# EAGLE design skull_white (EAGLE 9.5.2)
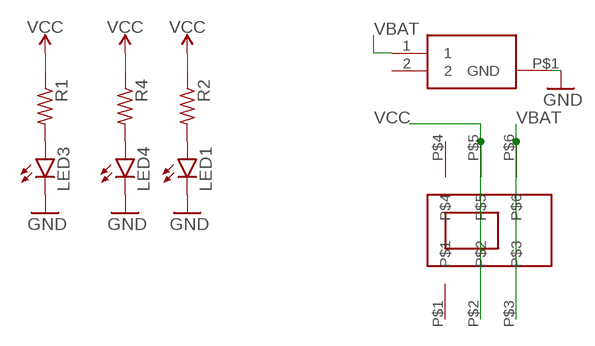
[diagram p0: schematic, sheet 1]

## Parts
LED1  LEDCHIP-LED0805  [CHIP-LED0805]
LED3  LEDCHIP-LED0805  [CHIP-LED0805]
LED4  LEDCHIP-LED0805  [CHIP-LED0805]
R1  R-US_R0603  [R0603]
R2  R-US_R0603  [R0603]
R4  R-US_R0603  [R0603]
U$1  CL-SB-22A-02T-SLIDE-SWITCH-TUCKED-PADS  [CL-SB-22A-02T-DPDT-COMPACT-SWITCH]
VBAT  BAT-HLD-012-SMT  [BATHLD012SMT]

## Nets
GND: LED1.C LED3.C LED4.C VBAT.P$1(GND)
N$1: LED1.A R2.2
N$3: LED3.A R1.2
N$4: LED4.A R4.2
VBAT: U$1.P$3 U$1.P$6 VBAT.1
VCC: R1.1 R2.1 R4.1 U$1.P$2 U$1.P$5
Unconnected: U$1.P$1 U$1.P$4 VBAT.2

## Library data of the parts
LED1 LED3 LED4 = led:LED: LED OSRAM: - CHIPLED LG R971, LG N971, LY N971, LG Q971, LY Q971, LO R971, LY R971 LH N974, LH R974 LS Q976, LO Q976, LY Q976 LO Q996 - Hyper CHIPLED LW Q18S LB Q993, LB Q99A, LB R99A - SideLED LS A670, LO A670, LY A670, LG A670, LP A670 LB A673, LV A673, LT A673, LW A673 LH A674 LY A675 LS A676, LA A676, LO A676, LY A676, LW A676 LS A679, LY A679, LG A679 - Hyper Micro SIDELED® LS Y876, LA Y876, LO Y876, LY Y876 LT Y87S - SmartLED LW L88C, LW L88S LB L89C, LB L89S, LG L890 LS L89K, LO L89K, LY L89K LS L896, LA L896, LO L896, LY L896 - TOPLED LS T670, LO T670, LY T670, LG T670, LP T670 LSG T670, LSP T670, LSY T670, LOP T670, LYG T670 LG T671, LOG T671, LSG T671 LB T673, LV T673, LT T673, LW T673 LH T674 LS T676, LA T676, LO T676, LY T676, LB T676, LH T676, LSB T676, LW T676 LB T67C, LV T67C, LT T67C, LS T67K, LO T67K, LY T67K, LW E67C LS E67B, LA E67B, LO E67B, LY E67B, LB E67C, LV E67C, LT E67C LW T67C LS T679, LY T679, LG T679 LS T770, LO T770, LY T770, LG T770, LP T770 LB T773, LV T773, LT T773, LW T773 LH T774 LS E675, LA E675, LY E675, LS T675 LS T776, LA T776, LO T776, LY T776, LB T776 LHGB T686 LT T68C, LB T68C - Hyper Mini TOPLED® LB M676 - Mini TOPLED Santana® LG M470 LS M47K, LO M47K, LY M47K Source: http://www.osram.convergy.de LUXEON: - LUMILED® LXK2-PW12-R00, LXK2-PW12-S00, LXK2-PW14-U00, LXK2-PW14-V00 LXK2-PM12-R00, LXK2-PM12-S00, LXK2-PM14-U00 LXK2-PE12-Q00, LXK2-PE12-R00, LXK2-PE12-S00, LXK2-PE14-T00, LXK2-PE14-U00 LXK2-PB12-K00, LXK2-PB12-L00, LXK2-PB12-M00, LXK2-PB14-N00, LXK2-PB14-P00, LXK2-PB14-Q00 LXK2-PR12-L00, LXK2-PR12-M00, LXK2-PR14-Q00, LXK2-PR14-R00 LXK2-PD12-Q00, LXK2-PD12-R00, LXK2-PD12-S00 LXK2-PH12-R00, LXK2-PH12-S00 LXK2-PL12-P00, LXK2-PL12-Q00, LXK2-PL12-R00 Source: www.luxeon.com KINGBRIGHT: KA-3528ASYC Source: www.kingbright.com
R1 R2 R4 = rcl:R-US_: RESISTOR, American symbol; SPICEPREFIX: R
U$1 = electroninks:CL-SB-22A-02T-SLIDE-SWITCH-TUCKED-PADS
VBAT = SamacSys_Parts:BAT-HLD-012-SMT: Coin Cell Battery Holders Bat Hld CR1216/1225 Surface Mount Source: Datasheet <https://componentsearchengine.com/Datasheets/1/BAT-HLD-012-SMT.pdf>; DESCRIPTION: Coin Cell Battery Holders Bat Hld CR1216/1225 Surface Mount; HEIGHT: 3mm; MANUFACTURER_NAME: Linx Technologies; MANUFACTURER_PART_NUMBER: BAT-HLD-012-SMT; MOUSER_PART_NUMBER: 712-BAT-HLD-012-SMT; MOUSER_PRICE-STOCK: https://www.mouser.com/Search/Refine.aspx?Keyword=712-BAT-HLD-012-SMT

## Board
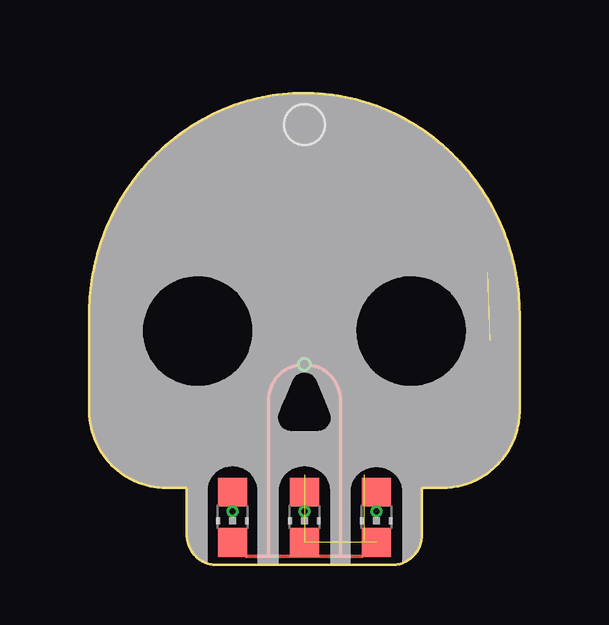
[diagram p1: board, top side]
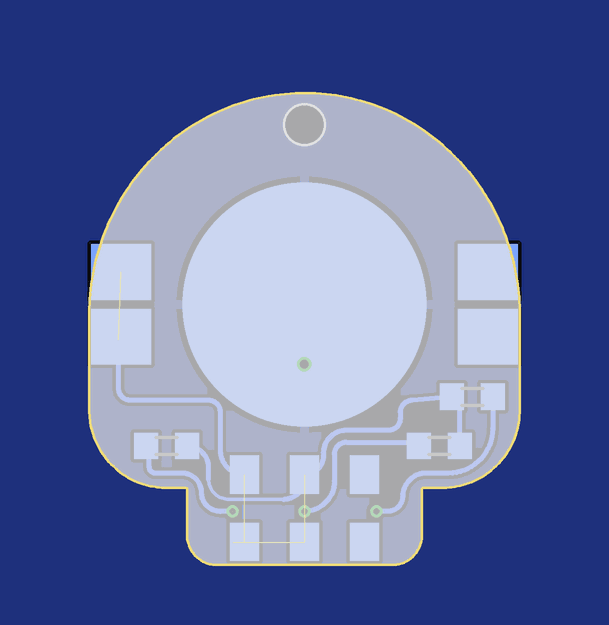
[diagram p2: board, bottom side, seen from below]

Size 17.96 x 19.68 mm. Coordinates in mm from the lower left corner, seen from the top.
Outline: 5.32,0 12.66,0 12.73,0 12.8,0.01 12.87,0.02 12.93,0.04 13,0.05 13.07,0.08 13.13,0.1 13.2,0.14 13.26,0.17 13.32,0.21 13.38,0.25 13.43,0.29 13.48,0.34 13.53,0.39 13.58,0.44 13.63,0.5 13.67,0.55 13.7,0.61 13.74,0.68 13.77,0.74 13.8,0.8 13.82,0.87 13.84,0.94 13.85,1.01 13.87,1.08 13.88,1.15 13.88,1.22 13.88,3.19 13.93,3.22 14.77,3.22 14.91,3.22 15.05,3.23 15.13,3.24 15.2,3.25 15.33,3.27 15.4,3.28 15.54,3.32 15.68,3.36 15.81,3.4 15.94,3.45 16.07,3.51 16.2,3.57 16.32,3.64 16.44,3.71 16.56,3.79 16.68,3.87 16.79,3.96 16.84,4 16.94,4.1 17.04,4.2 17.14,4.3 17.23,4.41 17.32,4.52 17.4,4.64 17.47,4.76 17.54,4.88 17.61,5 17.67,5.13 17.73,5.26 17.75,5.33 17.8,5.46 17.82,5.53 17.86,5.66 17.89,5.8 17.91,5.94 17.92,6.01 17.94,6.15 17.95,6.22 17.95,6.36 17.96,6.5 17.95,10.45 17.95,10.74 17.94,10.88 17.93,11.09 17.91,11.3 17.89,11.51 17.86,11.72 17.83,11.93 17.8,12.14 17.77,12.28 17.73,12.48 17.68,12.69 17.63,12.89 17.57,13.1 17.51,13.3 17.44,13.5 17.37,13.7 17.29,13.9 17.21,14.1 17.16,14.22 17.07,14.42 16.95,14.67 16.81,14.92 16.71,15.11 16.6,15.29 16.49,15.47 16.38,15.65 16.3,15.76 16.22,15.88 16.09,16.05 15.92,16.27 15.83,16.38 15.74,16.49 15.6,16.65 15.46,16.81 15.32,16.96 15.17,17.11 14.96,17.31 14.86,17.4 14.75,17.5 14.59,17.63 14.43,17.77 14.26,17.9 14.09,18.02 13.86,18.18 13.74,18.26 13.62,18.34 13.44,18.45 13.26,18.55 13.01,18.69 12.88,18.75 12.76,18.81 12.56,18.9 12.37,18.99 12.17,19.07 11.98,19.14 11.84,19.19 11.71,19.24 11.51,19.3 11.31,19.36 11.1,19.42 10.89,19.46 10.69,19.51 10.48,19.55 10.34,19.57 10.2,19.59 9.99,19.62 9.78,19.64 9.57,19.66 9.36,19.67 9.15,19.68 8.93,19.68 8.72,19.67 8.51,19.66 8.3,19.65 8.09,19.63 7.88,19.61 7.67,19.58 7.46,19.54 7.25,19.51 7.05,19.46 6.84,19.41 6.63,19.36 6.43,19.3 6.23,19.23 6.03,19.16 5.9,19.11 5.77,19.06 5.57,18.98 5.38,18.9 5.18,18.81 5,18.71 4.81,18.61 4.62,18.51 4.44,18.4 4.26,18.29 4.14,18.21 4.03,18.14 3.85,18.01 3.68,17.89 3.52,17.76 3.35,17.62 3.19,17.49 3.03,17.35 2.88,17.2 2.73,17.05 2.58,16.9 2.48,16.8 2.39,16.69 2.25,16.53 2.11,16.37 1.98,16.21 1.85,16.04 1.73,15.87 1.61,15.69 1.49,15.52 1.42,15.4 1.34,15.28 1.24,15.09 1.13,14.91 1.03,14.72 0.94,14.53 0.82,14.27 0.74,14.08 0.66,13.88 0.58,13.69 0.49,13.42 0.4,13.15 0.34,12.95 0.31,12.81 0.26,12.61 0.23,12.47 0.18,12.26 0.16,12.12 0.11,11.84 0.09,11.7 0.06,11.49 0.05,11.35 0.03,11.14 0.02,11 0.01,10.79 0,10.58 0,10.37 0,6.49 0,6.35 0.01,6.2 0.03,6.06 0.05,5.92 0.06,5.85 0.09,5.72 0.12,5.58 0.14,5.51 0.19,5.38 0.24,5.25 0.29,5.12 0.35,4.99 0.42,4.86 0.49,4.74 0.57,4.62 0.65,4.51 0.69,4.45 0.78,4.34 0.87,4.24 0.97,4.14 1.08,4.04 1.18,3.95 1.29,3.86 1.41,3.78 1.52,3.7 1.65,3.63 1.77,3.56 1.9,3.5 2.03,3.44 2.09,3.42 2.23,3.37 2.36,3.33 2.5,3.3 2.64,3.27 2.71,3.26 2.85,3.24 2.92,3.23 3.06,3.22 3.2,3.22 4.04,3.22 4.07,3.18 4.07,1.27 4.08,1.2 4.08,1.13 4.09,1.06 4.1,0.99 4.12,0.92 4.14,0.86 4.17,0.79 4.19,0.72 4.22,0.66 4.26,0.6 4.3,0.54 4.34,0.48 4.38,0.43 4.43,0.38 4.48,0.33 4.54,0.28 4.59,0.24 4.65,0.2 4.71,0.16 4.77,0.13 4.84,0.1 4.9,0.07 4.97,0.05 5.04,0.03 5.11,0.02 5.18,0.01 5.25,0 5.32,0
Copper layers (1*16): Top 0.035559375mm / dielectric 1.6mm / Bottom 0.035559375mm
Design rules "oshpark-2layer *": minimum track width 6mil, minimum drill 10mil, track to track 6mil, track to pad 6mil, pad to pad 6mil, via to via 6mil, smd to smd 6mil, copper to edge 0mil, drill to drill 6mil, minimum pad ring 5mil, minimum via ring 5mil, stop-mask expansion 2.5mil, vias tented up to drill 0.35mm, thermal gap 10mil
Holes 1.7 mm at 8.98,18.36

### Footprints (pad centres in the part's own frame; a part is rotated, then mirrored left to right if it is on the bottom)
CHIP-LED0805 = smd 1.2 x 1.2: A 0,-1.05; C 0,1.05
R0603 = smd 1 x 1.1: 1 -0.85,0; 2 0.85,0
CL-SB-22A-02T-DPDT-COMPACT-SWITCH = smd 1.2 x 1.6: P$1 -2.5,-1.4; P$2 0,-1.4; P$3 2.5,-1.4; P$4 -2.5,1.4; P$5 0,1.4; P$6 2.5,1.4
BATHLD012SMT = smd 2.5 x 2.325: 1 -7.65,1.35; 2 7.65,1.35; P$2 -7.65,-1.35; P$3 7.65,-1.35 | smd 10.2 x 10.2: P$1 0,0

### Placement (x,y rotation side)
LED1  5.98,1.99 180 top
LED3  8.98,1.99 180 top
LED4  11.98,1.99 180 top
R1  3.36,4.96 180 bottom
R2  1.98,7.01 0 bottom
R4  14.73,4.96 180 bottom
U$1  8.98,2.36 180 bottom
VBAT  8.98,10.86 0 bottom

### Tracks (layer width: path | path; a pad name or v marks a point on that pad's centre or on a via)
GND  (via drill 0.35)  (1 unrouted)
  Top 0.152: LED1.C 6.56,0.36 7.48,0.36 | LED4.C 11.41,0.36 10.48,0.36 | 7.48,0.36 10.48,0.36 | 7.48,0.36 7.48,6.86 arc-90 v8.98,8.36 arc-90 10.48,6.86 10.48,0.36
  pour Bottom (rank 3): -5.77,-5.14 23.98,-5.14 23.98,24.86 -6.02,24.86 -6.02,-5.14
N$1  (via drill 0.25)
  Top 0.152: 5.98,2.19 v5.98,2.24
  Top 0.203: v5.98,2.24 LED1.A
  Bottom 0.203: R2.2 1.13,5.67 arc90 2.98,3.83 3.91,3.83 arc-90 4.88,2.85 arc90 5.5,2.24 v5.98,2.24
N$3  (via drill 0.25)
  Top 0.203: v8.98,2.24 LED3.A
  Bottom 0.203: 4.23,5.11 7.23,5.11 arc-90 7.73,4.61 7.73,3.49 arc90 v8.98,2.24 | 4.23,5.11 3.98,5.11 | R1.2 4.21,5.09 arc-90 4.23,5.11
N$4  (via drill 0.25)  (1 unrouted)
  Top 0.203: v11.98,2.24 LED4.A
  Bottom 0.152: 15.46,4.86 15.46,4.94 arc-90 R4.2
  Bottom 0.203: v11.99,2.23 12.49,2.23 arc90 13.27,3.01 arc-90 14.08,3.82 15.19,3.82 arc90 15.46,4.09 15.46,4.86
VBAT  (2 unrouted)
  Bottom 0.203: U$1.P$3 arc90 12.48,4.76 12.48,6.36 arc-90 12.98,6.86 16.23,6.86 arc90 16.73,7.36 16.73,9.36
VCC  (1 unrouted)
  Bottom 0.152: 9.84,2.73 12.13,2.73 arc90 12.98,3.58
  Bottom 0.203: 13.51,5.11 arc-90 R4.1 arc90 12.98,4.09 12.98,3.58 | 9.84,2.73 arc-90 8.98,3.59 U$1.P$2 arc-90 8.19,4.55 8.19,4.68 arc90 7.25,5.61 5.48,5.61 arc-90 4.98,6.11 4.98,6.36 arc90 4.48,6.86 R2.1 arc90 2.51,6.54 R1.1